# EAGLE design FieldsControls (EAGLE 9.6.2)
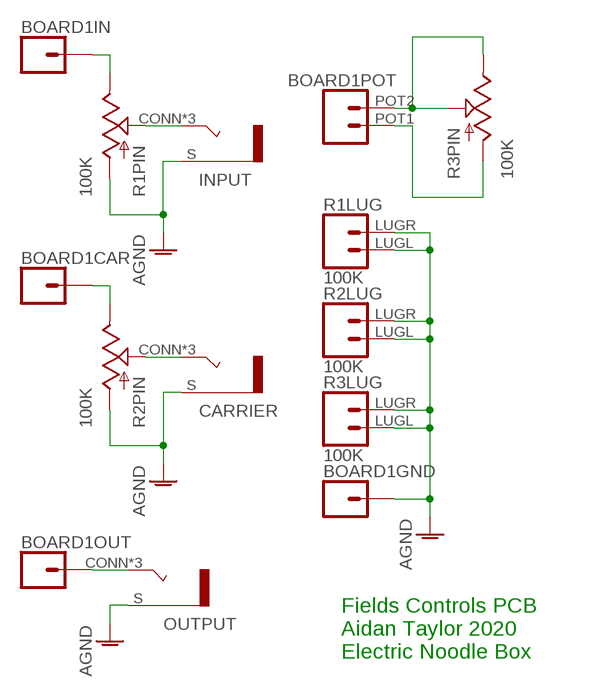
[diagram p0: schematic, sheet 1]

## Parts
BOARD1  FIELDS_LINK  [FIELDS]
CARRIER  COMBI-JACKCINCHNANA  [NEWCOMBOJACK_PANEL]
INPUT  COMBI-JACKCINCHNANA  [NEWCOMBOJACK_PANEL]
OUTPUT  COMBI-JACKCINCHNANA  [NEWCOMBOJACK_PANEL]
R1  100K  POTENTIOMETER  [ALPHA_RV09_9MMPOT]
R2  100K  POTENTIOMETER  [ALPHA_RV09_9MMPOT]
R3  100K  POTENTIOMETER  [ALPHA_RV09_9MMPOT]

## Nets
AGND: BOARD1.GND BOARD1.GND2 CARRIER.S INPUT.S OUTPUT.S R1.C1(PIN:A) R1.LUGL R1.LUGR R2.C1(PIN:A) R2.LUGL R2.LUGR R3.LUGL R3.LUGR
N$1: BOARD1.IN R1.C3(PIN:B)
N$2: INPUT.CONN(T) INPUT.T1(T) INPUT.T2(T) R1.C2(PIN:W)
N$3: BOARD1.OUT OUTPUT.CONN(T) OUTPUT.T1(T) OUTPUT.T2(T)
N$4: BOARD1.CAR R2.C3(PIN:B)
N$5: CARRIER.CONN(T) CARRIER.T1(T) CARRIER.T2(T) R2.C2(PIN:W)
N$6: BOARD1.POT1 R3.C1(PIN:A)
N$7: BOARD1.POT2 R3.C2(PIN:W) R3.C3(PIN:B)

## Notes on the sheet
- Fields Controls PCB
  Aidan Taylor 2020
  Electric Noodle Box

## Library data of the parts
BOARD1 = ElectricNoodleBox:FIELDS_LINK
CARRIER INPUT OUTPUT = ElectricNoodleBox:COMBI-JACK
R1-R3 = ElectricNoodleBox:POTENTIOMETER

## Board
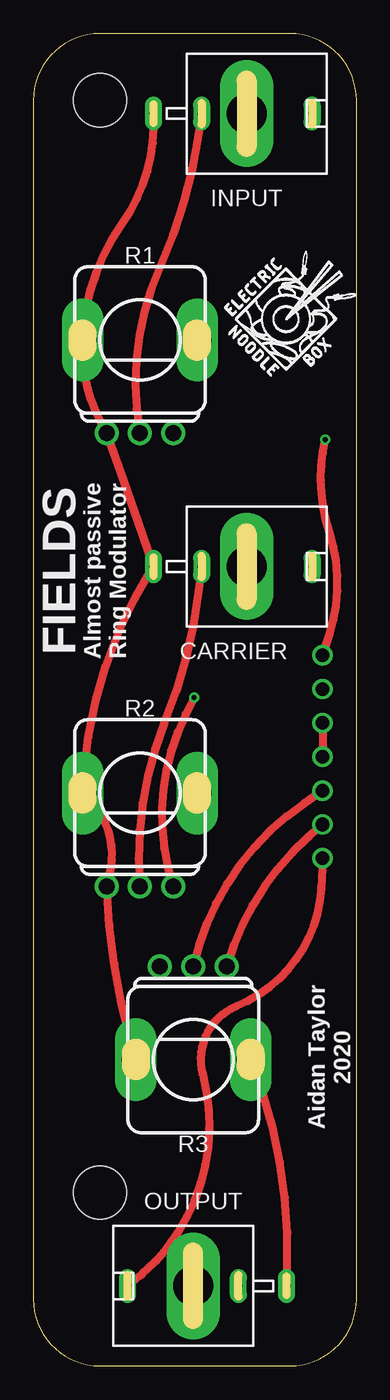
[diagram p1: board, top side]
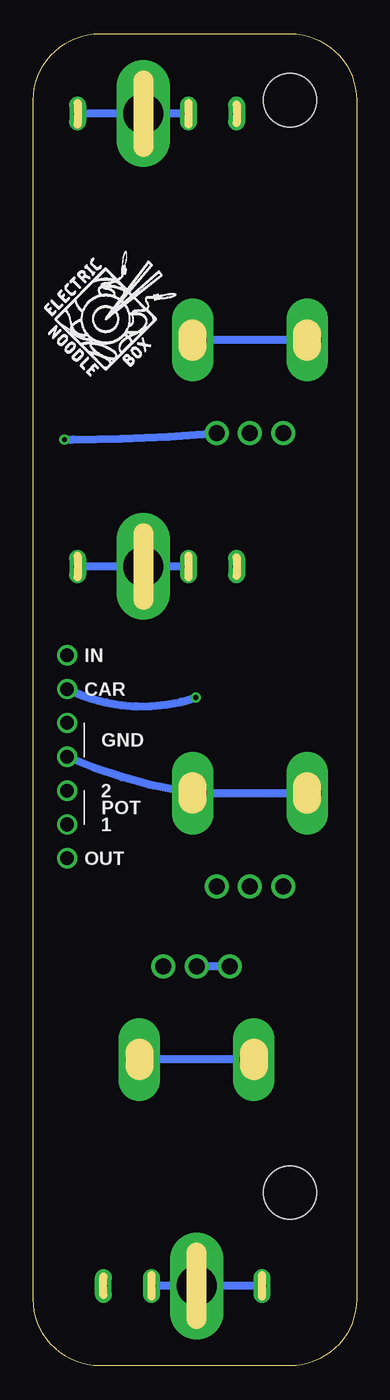
[diagram p2: board, bottom side, seen from below]

Size 24.25 x 100 mm. Coordinates in mm from the lower left corner, seen from the top.
Outline: 0,95 0,5 arc90 5,0 19.25,0 arc90 24.25,5 24.25,95 arc90 19.25,100 5,100 arc90 0,95
Copper layers (1*16): Top 0.035mm / dielectric 1.5mm / Bottom 0.035mm
Design rules "default": minimum track width 6mil, minimum drill 0.35mm, track to track 6mil, track to pad 6mil, pad to pad 6mil, via to via 6mil, smd to smd 6mil, copper to edge 40mil, drill to drill 6mil, minimum pad ring 10mil, minimum via ring 8mil, stop-mask expansion 4mil, vias tented up to drill 0mil, thermal gap 10mil

### Footprints (pad centres in the part's own frame; a part is rotated, then mirrored left to right if it is on the bottom)
FIELDS = drill 1.016: CAR 2.54,50.8; GND 2.54,45.72; GND2 2.54,48.26; IN 2.54,53.34; OUT 2.54,38.1; POT1 2.54,40.64; POT2 2.54,43.18 | hole 4: 19.25,13; 19.25,95
NEWCOMBOJACK_PANEL = drill 3 pad 3.6 long: CONN 0,0 | drill 0.6 pad 1.27 long: S 0,-7; T1 0,4.92; T2 0,-3.38
ALPHA_RV09_9MMPOT = drill 1.2 pad 1.778: C1 -2.5,-7; C2 0,-7; C3 2.5,-7 | drill 2.1 pad 2.8 long: LUGL -4.3,0; LUGR 4.3,0

### Placement (x,y rotation side)
BOARD1  24.25,0 0 bottom
CARRIER  16,60 270 top
INPUT  16,94 270 top
OUTPUT  12,6 90 top
R1  8,77 0 top
R2  8,43 0 top
R3  12,23 180 top
U$1  [LOGO10X10]  14.29,73.98 0 top
U$2  [LOGO10X10]  23.5,73.98 0 bottom

### Tracks (layer width: path | path; a pad name or v marks a point on that pad's centre or on a via)
AGND
  Top 0.61: BOARD1.GND2 BOARD1.GND | INPUT.S arc-39 6.67,85.72 arc30 3.81,78.11 R1.LUGL arc30 5.08,70.8 R1.C1 arc-2 8.57,61.28 CARRIER.S arc28 3.81,44.45 R2.LUGL arc-65 5.71,36.83 R2.C1 arc13 7.3,24.45 R3.LUGR | OUTPUT.S 19.05,7.3 arc24 R3.LUGL
  Bottom 0.61: BOARD1.GND arc-14 13.34,43.18 R2.LUGR R2.LUGL | R1.LUGL R1.LUGR | R3.LUGR R3.LUGL
N$1  (via drill 0.35)
  Top 0.61: BOARD1.IN 22.23,54.93 arc36 22.23,62.55 arc-31 v21.91,69.53
  Bottom 0.61: v21.91,69.53 21.27,69.53 arc-5 R1.C3
N$2
  Top 0.61: INPUT.T2 12.38,92.39 arc-16 9.53,82.55 arc34 R1.C2
  Bottom 0.61: INPUT.T2 INPUT.CONN INPUT.T1
N$3
  Top 0.61: BOARD1.OUT 21.59,35.88 arc-65 15.24,26.99 arc83 12.7,21.91 arc-69 OUTPUT.T1
  Bottom 0.61: OUTPUT.T1 OUTPUT.CONN OUTPUT.T2
N$4  (via drill 0.35)
  Top 0.61: v12.06,50.16 11.43,48.9 arc45 R2.C3
  Bottom 0.61: BOARD1.CAR 20.95,50.48 arc-42 v12.06,50.16
N$5
  Top 0.61: CARRIER.T2 12.38,58.1 arc-15 9.84,48.26 arc27 R2.C2
  Bottom 0.61: CARRIER.T2 CARRIER.CONN CARRIER.T1
N$6
  Top 0.61: BOARD1.POT1 20.64,39.69 arc32 R3.C1
N$7
  Top 0.61: BOARD1.POT2 20.32,42.23 arc43 R3.C2
  Bottom 0.61: R3.C3 R3.C2

### Text on the board
tPlace: FIELDS | Almost passive / Ring Modulator | Aidan Taylor / 2020